# EAGLE schematic frontplatine_final (EAGLE 6.3)
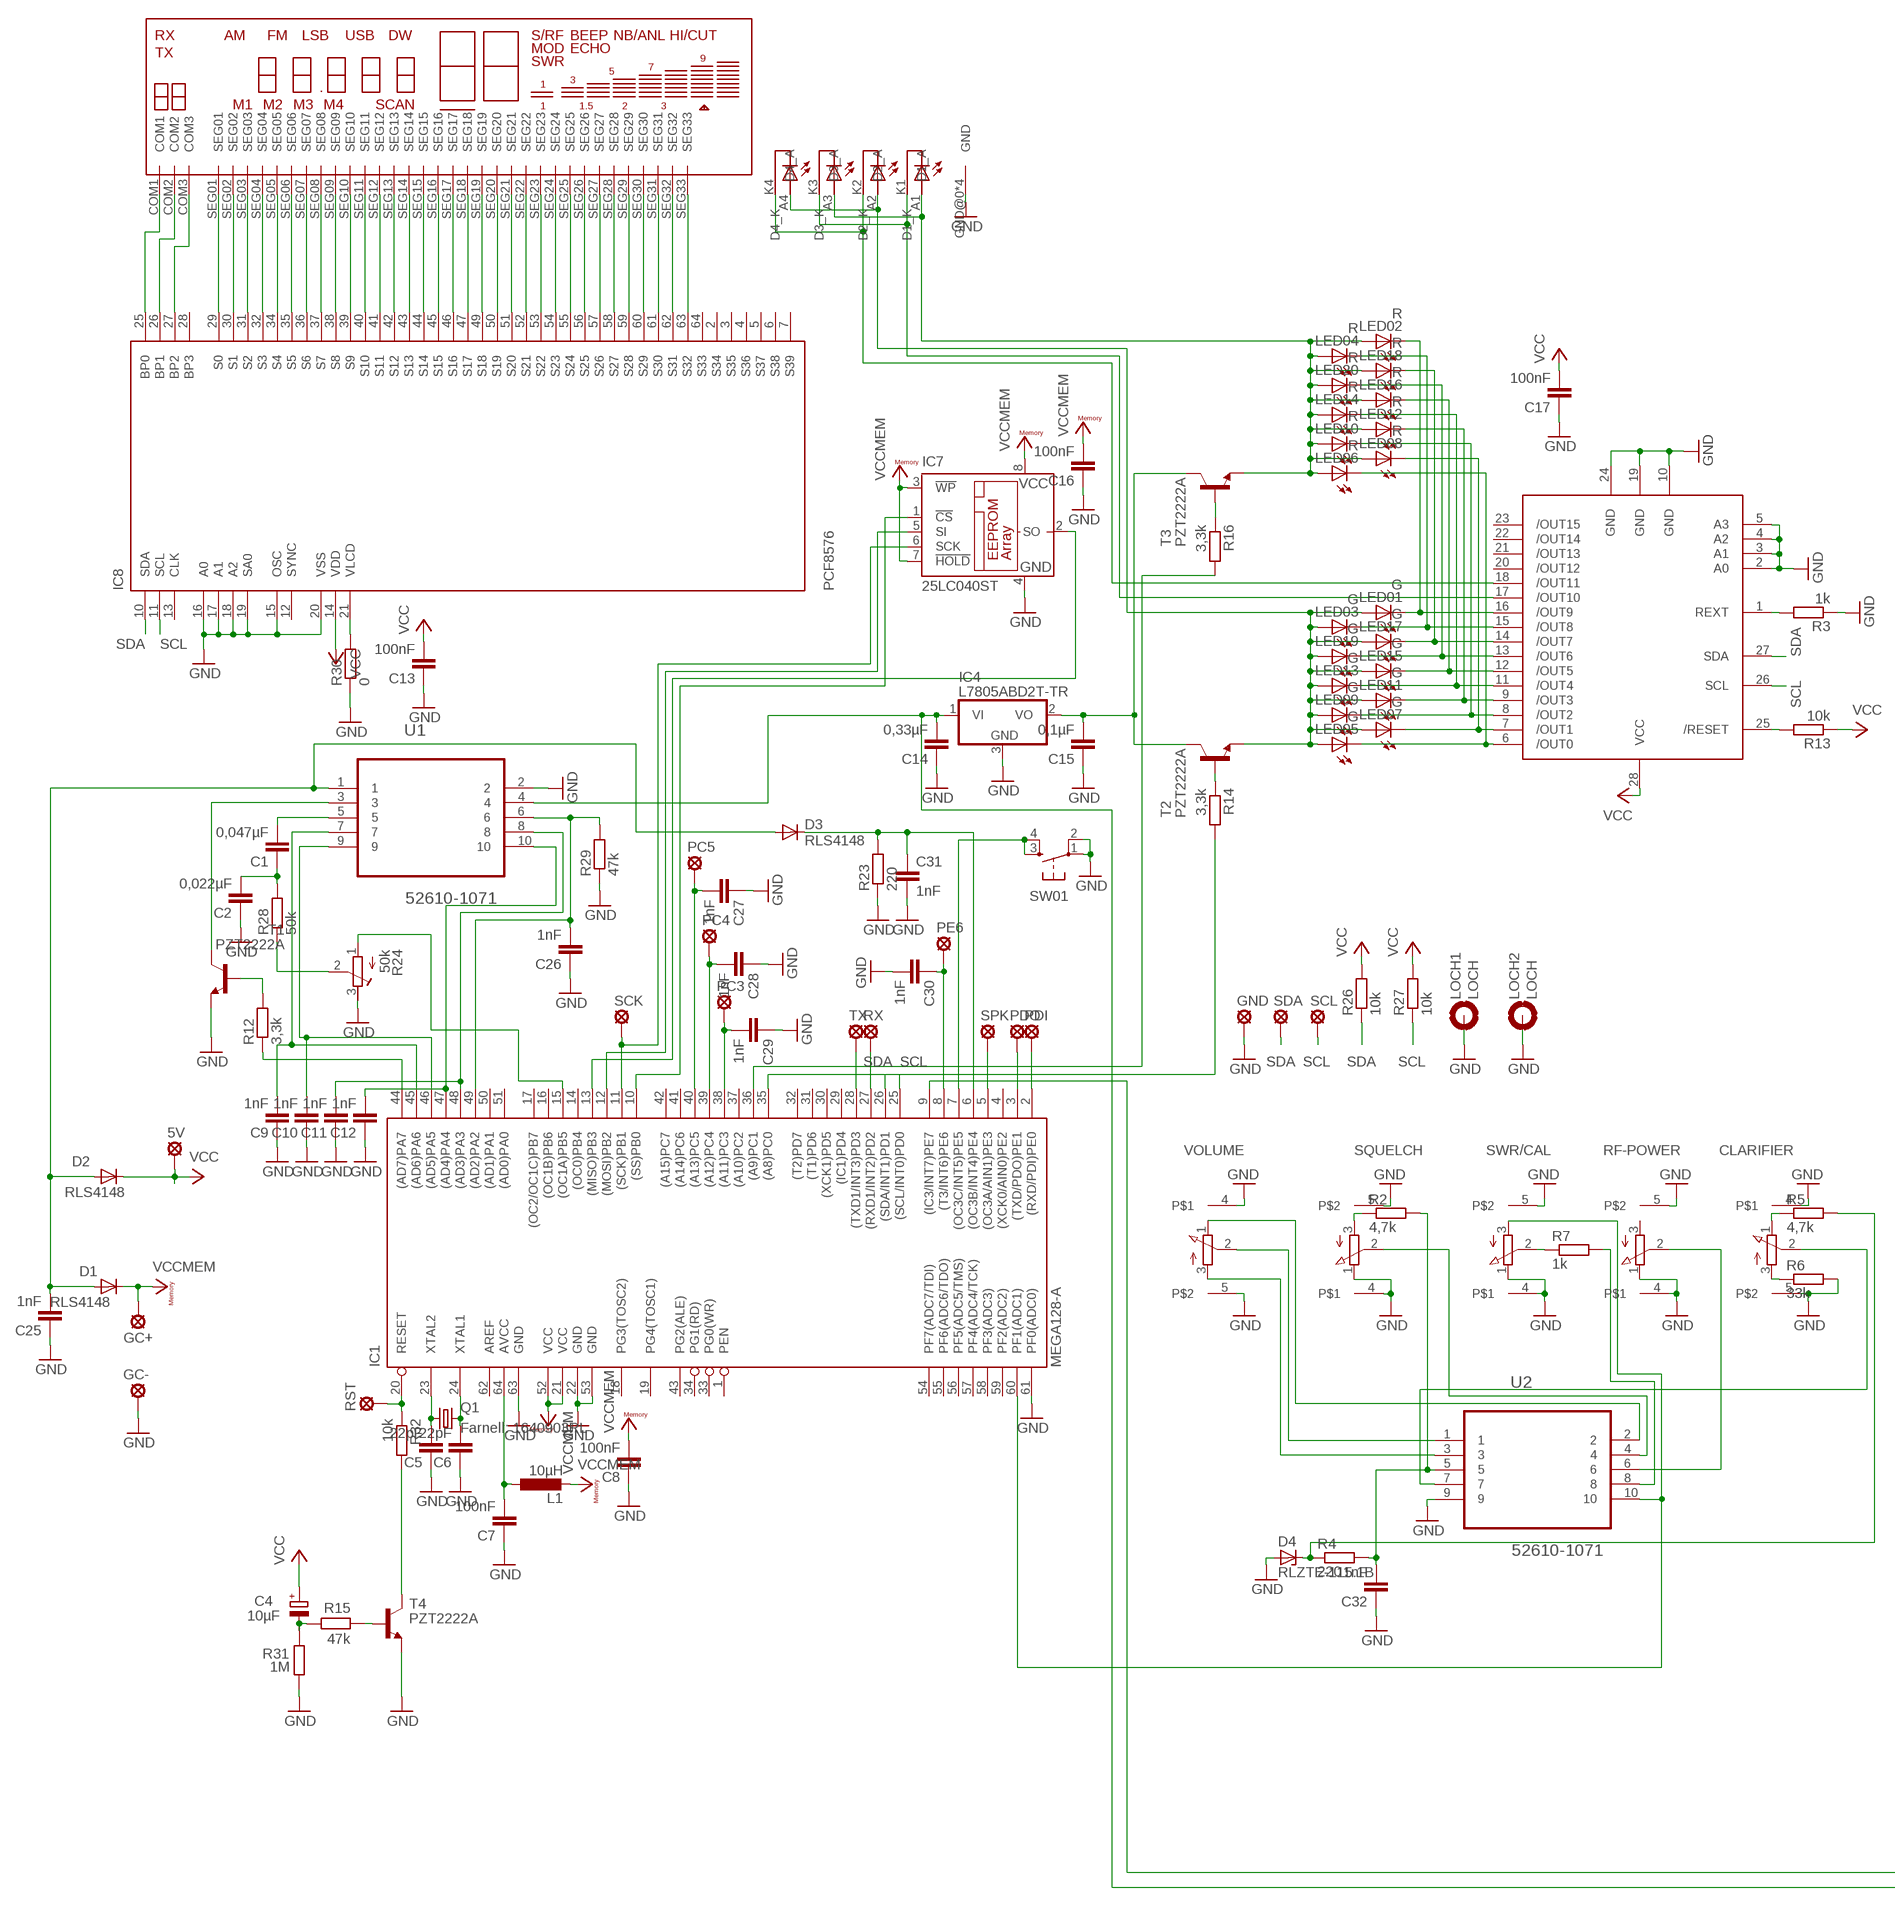
[diagram p0: schematic, sheet 1, part 1 of 2]
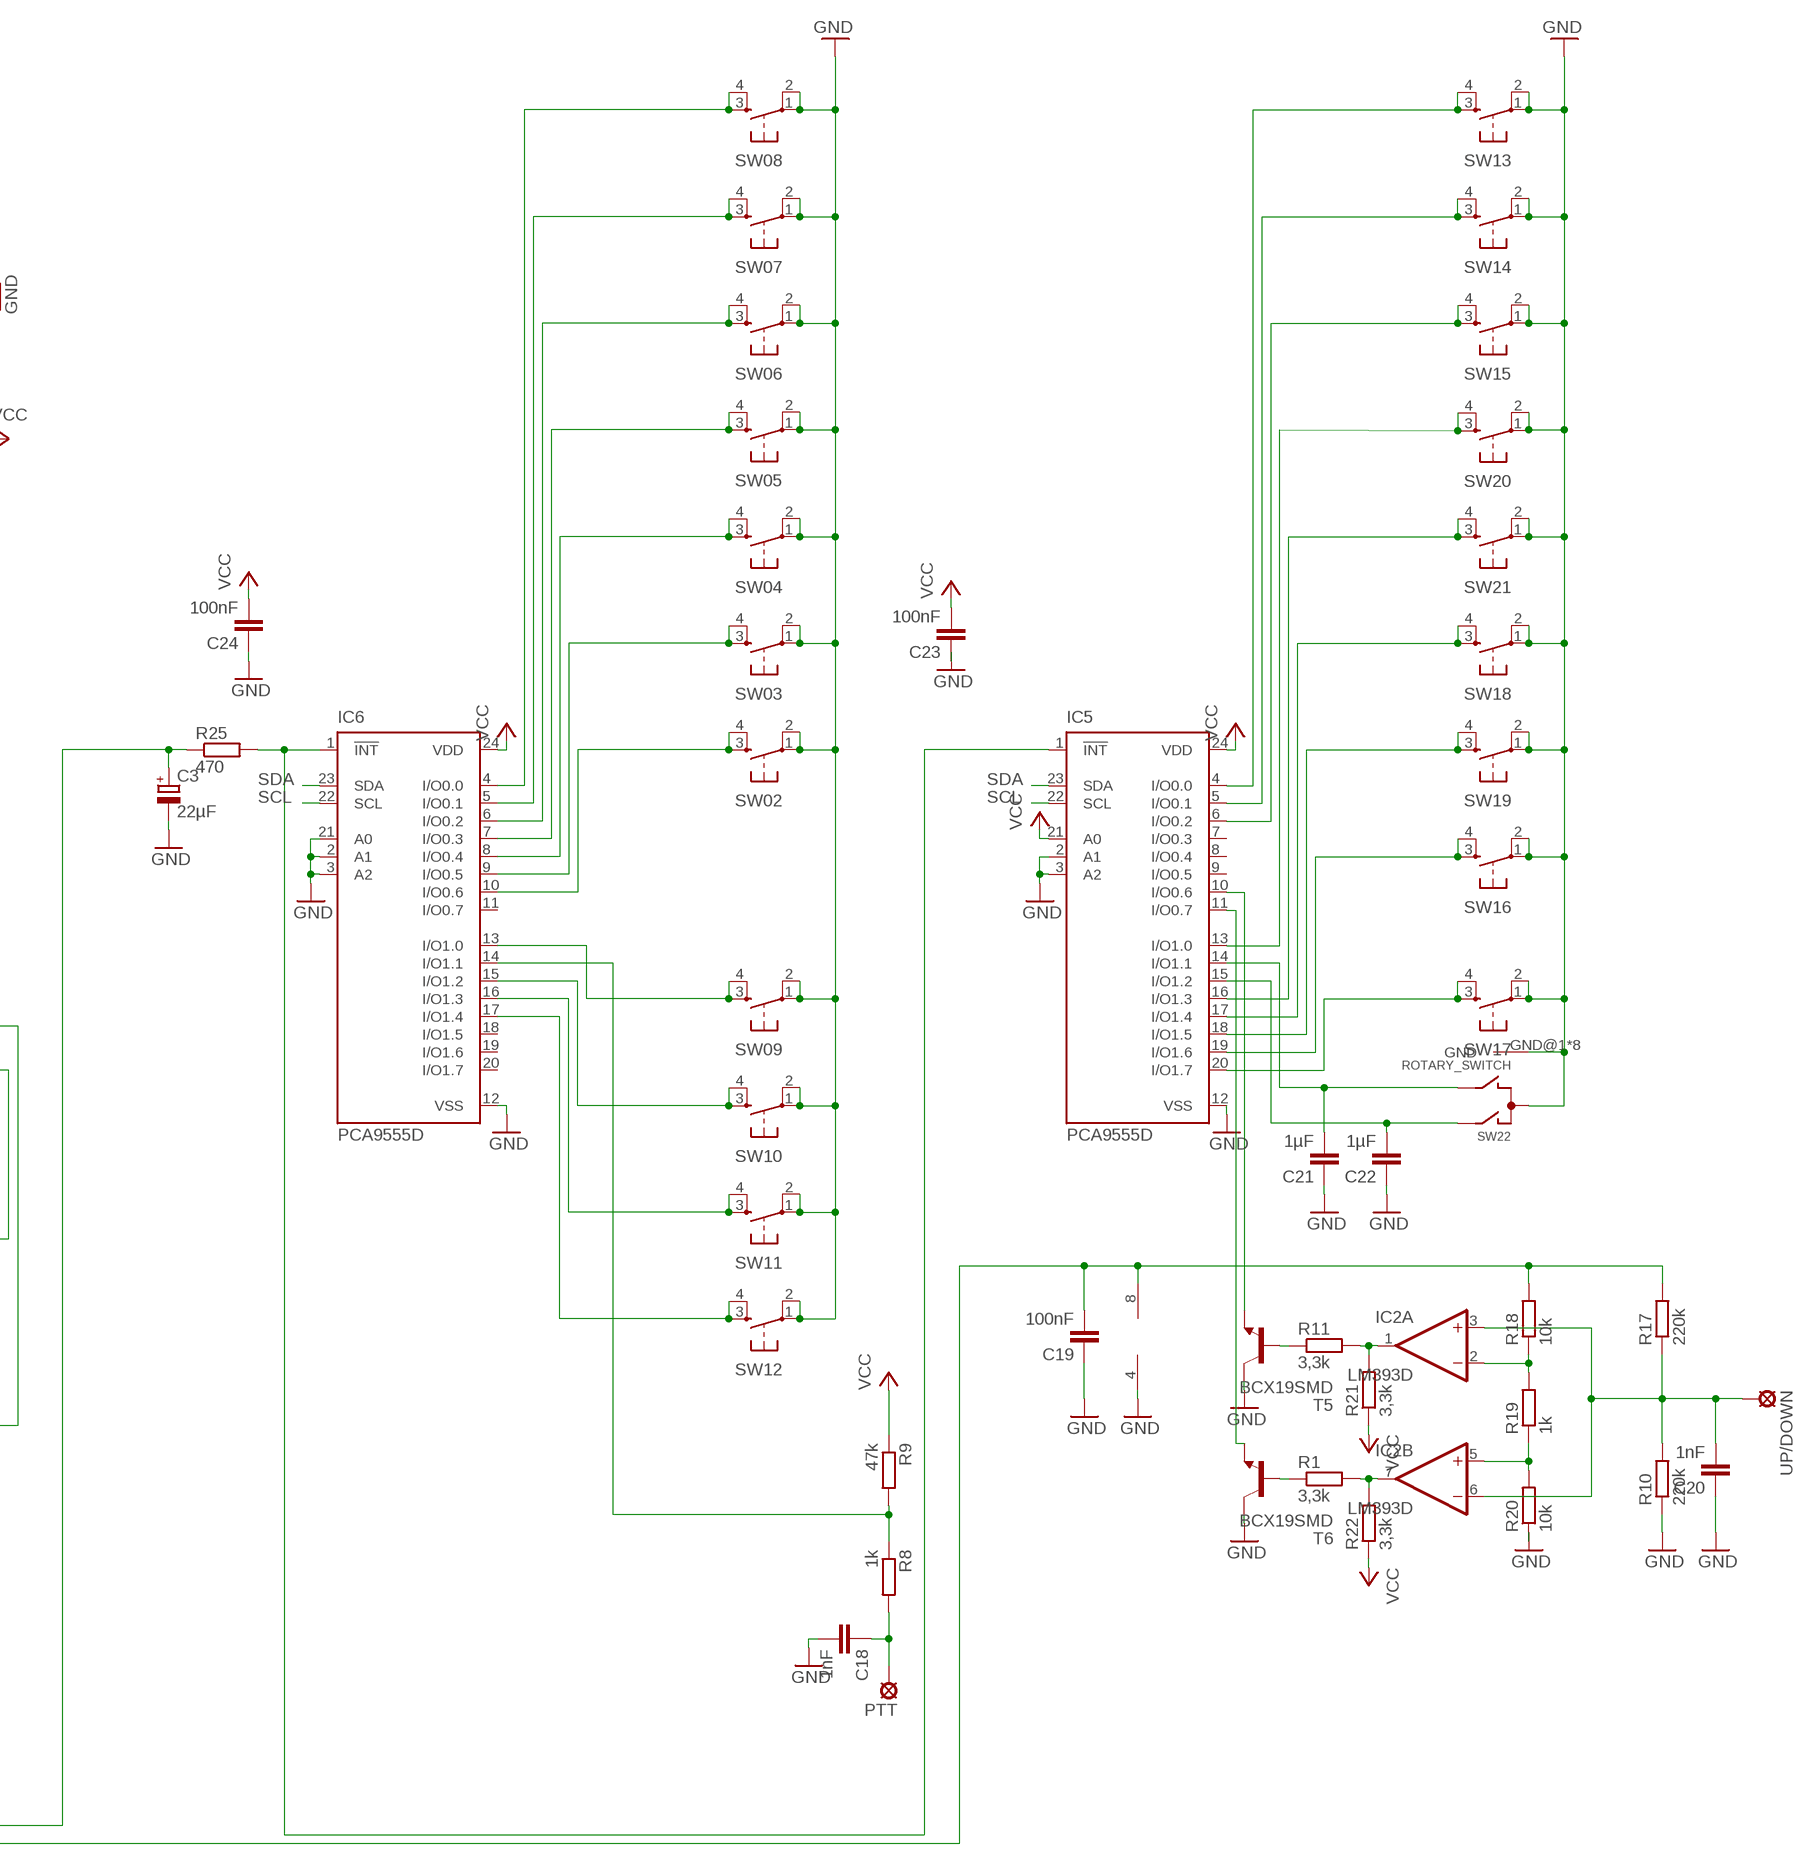
[diagram p1: schematic, sheet 1, part 2 of 2]

## Parts
5V  SE11  [SE11]
C1  0,047µF  C-EUC1206  [C1206]
C2  0,022µF  C-EUC1206  [C1206]
C3  22µF  CPOL-EUCT3216  [CT3216]
C4  10µF  CPOL-EUCT3216  [CT3216]
C5  22pF  C-EUC1206  [C1206]
C6  22pF  C-EUC1206  [C1206]
C7  100nF  C-EUC1206  [C1206]
C8  100nF  C-EUC1206  [C1206]
C9  1nF  C-EUC1206  [C1206]
C10  1nF  C-EUC1206  [C1206]
C11  1nF  C-EUC1206  [C1206]
C12  1nF  C-EUC1206  [C1206]
C13  100nF  C-EUC1206  [C1206]
C14  0,33µF  C-EUC1206  [C1206]
C15  0,1µF  C-EUC1206  [C1206]
C16  100nF  C-EUC1206  [C1206]
C17  100nF  C-EUC1206  [C1206]
C18  1nF  C-EUC1206  [C1206]
C19  100nF  C-EUC1206  [C1206]
C20  1nF  C-EUC1206  [C1206]
C21  1µF  C-EUC1206  [C1206]
C22  1µF  C-EUC1206  [C1206]
C23  100nF  C-EUC1206  [C1206]
C24  100nF  C-EUC1206  [C1206]
C25  1nF  C-EUC1206  [C1206]
C26  1nF  C-EUC1206  [C1206]
C27  1nF  C-EUC1206  [C1206]
C28  1nF  C-EUC1206  [C1206]
C29  1nF  C-EUC1206  [C1206]
C30  1nF  C-EUC1206  [C1206]
C31  1nF  C-EUC1206  [C1206]
C32  1nF  C-EUC1206  [C1206]
CLARIFIER  POTI  [POTI]
D1  RLS4148  DIODE-SOD80C  [SOD80C]
D2  RLS4148  DIODE-SOD80C  [SOD80C]
D3  RLS4148  DIODE-SOD80C  [SOD80C]
D4  RLZTE-115.1B  ZENER-DIODESOD80C  [SOD80C]
DISPLAY1  DISPLAY  [DISPLAY]
GC+  SE11  [SE11]
GC-  SE11  [SE11]
GND  SE11  [SE11]
IC1  MEGA128-A  [TQFP64]
IC2  LM393D  [SO08]
IC3  TLC59116  [TSSOP28]
IC4  L7805ABD2T-TR  7805DT  [TO252]
IC5  PCA9555D  [SO24]
IC6  PCA9555D  [SO24]
IC7  25LC040ST  [TSSOP8]
IC8  PCF8576  [64LQFP]
L1  10µH  L-EUL1812  [L1812]
LED01  G  LEDCHIPLED_1206  [CHIPLED_1206]
LED02  R  LEDCHIPLED_1206  [CHIPLED_1206]
LED03  G  LEDCHIPLED_1206  [CHIPLED_1206]
LED04  R  LEDCHIPLED_1206  [CHIPLED_1206]
LED05  G  LEDCHIPLED_1206  [CHIPLED_1206]
LED06  R  LEDCHIPLED_1206  [CHIPLED_1206]
LED07  G  LEDCHIPLED_1206  [CHIPLED_1206]
LED08  R  LEDCHIPLED_1206  [CHIPLED_1206]
LED09  G  LEDCHIPLED_1206  [CHIPLED_1206]
LED10  R  LEDCHIPLED_1206  [CHIPLED_1206]
LED11  G  LEDCHIPLED_1206  [CHIPLED_1206]
LED12  R  LEDCHIPLED_1206  [CHIPLED_1206]
LED13  G  LEDCHIPLED_1206  [CHIPLED_1206]
LED14  R  LEDCHIPLED_1206  [CHIPLED_1206]
LED15  G  LEDCHIPLED_1206  [CHIPLED_1206]
LED16  R  LEDCHIPLED_1206  [CHIPLED_1206]
LED17  G  LEDCHIPLED_1206  [CHIPLED_1206]
LED18  R  LEDCHIPLED_1206  [CHIPLED_1206]
LED19  G  LEDCHIPLED_1206  [CHIPLED_1206]
LED20  R  LEDCHIPLED_1206  [CHIPLED_1206]
LOCH1  LOCH  [LOCH]
LOCH2  LOCH  [LOCH]
PC3  SE11  [SE11]
PC4  SE11  [SE11]
PC5  SE11  [SE11]
PDI  SE11  [SE11]
PDO  SE11  [SE11]
PE6  SE11  [SE11]
PTT  SE11  [SE11]
Q1  Farnell: 1640903RL  CRYSTALHC49UP  [HC49UP]
R1  3,3k  R-EU_R1206  [R1206]
R2  4,7k  R-EU_R1206  [R1206]
R3  1k  R-EU_R1206  [R1206]
R4  220  R-EU_R1206  [R1206]
R5  4,7k  R-EU_R1206  [R1206]
R6  33k  R-EU_R1206  [R1206]
R7  1k  R-EU_R1206  [R1206]
R8  1k  R-EU_R1206  [R1206]
R9  47k  R-EU_R1206  [R1206]
R10  220k  R-EU_R1206  [R1206]
R11  3,3k  R-EU_R1206  [R1206]
R12  3,3k  R-EU_R1206  [R1206]
R13  10k  R-EU_R1206  [R1206]
R14  3,3k  R-EU_R1206  [R1206]
R15  47k  R-EU_R1206  [R1206]
R16  3,3k  R-EU_R1206  [R1206]
R17  220k  R-EU_R1206  [R1206]
R18  10k  R-EU_R1206  [R1206]
R19  1k  R-EU_R1206  [R1206]
R20  10k  R-EU_R1206  [R1206]
R21  3,3k  R-EU_R1206  [R1206]
R22  3,3k  R-EU_R1206  [R1206]
R23  220  R-EU_R1206  [R1206]
R24  50k  R-TRIMM3314J  [RTRIM3314J]
R25  470  R-EU_R1206  [R1206]
R26  10k  R-EU_R1206  [R1206]
R27  10k  R-EU_R1206  [R1206]
R28  50k  R-EU_R1206  [R1206]
R29  47k  R-EU_R1206  [R1206]
R30  0  R-EU_R1206  [R1206]
R31  1M  R-EU_R1206  [R1206]
R32  10k  R-EU_R1206  [R1206]
RF-POWER  POTI  [POTI]
RST  SE11  [SE11]
RX  SE11  [SE11]
SCK  SE11  [SE11]
SCL  SE11  [SE11]
SDA  SE11  [SE11]
SPK  SE11  [SE11]
SQUELCH  POTI  [POTI]
SW01  TASTER  [TASTER]
SW02  TASTER  [TASTER]
SW03  TASTER  [TASTER]
SW04  TASTER  [TASTER]
SW05  TASTER  [TASTER]
SW06  TASTER  [TASTER]
SW07  TASTER  [TASTER]
SW08  TASTER  [TASTER]
SW09  TASTER  [TASTER]
SW10  TASTER  [TASTER]
SW11  TASTER  [TASTER]
SW12  TASTER  [TASTER]
SW13  TASTER  [TASTER]
SW14  TASTER  [TASTER]
SW15  TASTER  [TASTER]
SW16  TASTER  [TASTER]
SW17  TASTER  [TASTER]
SW18  TASTER  [TASTER]
SW19  TASTER  [TASTER]
SW20  TASTER  [TASTER]
SW21  TASTER  [TASTER]
SW22  ROTARY_SWITCH  [ROTARY_SWITCH]
SWR/CAL  POTI  [POTI]
T1  PZT2222A  PZT2222A-NPN-SOT223  [SOT223]
T2  PZT2222A  PZT2222A-NPN-SOT223  [SOT223]
T3  PZT2222A  PZT2222A-NPN-SOT223  [SOT223]
T4  PZT2222A  PZT2222A-NPN-SOT223  [SOT223]
T5  BCX19SMD  [SOT23-BEC]
T6  BCX19SMD  [SOT23-BEC]
TX  SE11  [SE11]
U1  52610-1071  [MOLEX_52610-1071]
U2  52610-1071  [MOLEX_52610-1071]
UP/DOWN  SE11  [SE11]
VOLUME  POTI  [POTI]

## Nets
GND [GND]: C2.1 C3.- C5.1 C6.1 C7.1 C8.1 C9.1 C10.1 C11.1 C12.1 C13.1 C14.1 C15.1 C16.1 C17.1 C18.2 C19.1 C20.1 C21.1 C22.1 C23.1 C24.1 C25.1 C26.1 C27.1 C28.1 C29.1 C30.2 C31.2 C32.1 CLARIFIER.4 CLARIFIER.5 D4.A DISPLAY1.GND@0(GND) DISPLAY1.GND@3(GND) DISPLAY1.GND@6(GND) DISPLAY1.GND@7(GND) GC-.MP GND.MP IC1.22(GND) IC1.53(GND) IC1.61(PF0(ADC0)) IC1.63(GND) IC2.4(P:V-) IC3.2(A0) IC3.3(A1) IC3.4(A2) IC3.5(A3) IC3.10(GND) IC3.19(GND) IC3.24(GND) IC4.3(GND) IC5.2(A1) IC5.3(A2) IC5.12(VSS) IC6.2(A1) IC6.3(A2) IC6.12(VSS) IC6.21(A0) IC7.4(GND) IC8.15(OSC) IC8.16(A0) IC8.17(A1) IC8.18(A2) IC8.19(SA0) IC8.20(VSS) LOCH1.B3,0(MOUNT) LOCH2.B3,0(MOUNT) R3.1 R6.2 R10.1 R20.1 R23.1 R24.3(A) R29.1 R30.1 R31.2 RF-POWER.1(E) RF-POWER.4 RF-POWER.5 SQUELCH.1(E) SQUELCH.4 SQUELCH.5 SW01.1 SW01.2 SW02.1 SW02.2 SW03.1 SW03.2 SW04.1 SW04.2 SW05.1 SW05.2 SW06.1 SW06.2 SW07.1 SW07.2 SW08.1 SW08.2 SW09.1 SW09.2 SW10.1 SW10.2 SW11.1 SW11.2 SW12.1 SW12.2 SW13.1 SW13.2 SW14.1 SW14.2 SW15.1 SW15.2 SW16.1 SW16.2 SW17.1 SW17.2 SW18.1 SW18.2 SW19.1 SW19.2 SW20.1 SW20.2 SW21.1 SW21.2 SW22.C SW22.GND@1(GND) SW22.GND@2(GND) SW22.GND@3(GND) SW22.GND@4(GND) SW22.GND@5(GND) SW22.GND@6(GND) SW22.GND@7(GND) SW22.GND@8(GND) SWR/CAL.1(E) SWR/CAL.4 SWR/CAL.5 T1.3(E) T4.3(E) T5.C T6.C U1.2 U2.9 VOLUME.4 VOLUME.5
N$1: DISPLAY1.SEG01 IC8.29(S0)
N$2: U2.1 VOLUME.2(S)
N$3: U2.2 VOLUME.1(E)
N$4: U2.3 VOLUME.3(A)
N$5: D4.C R4.1 R5.2
N$6: SQUELCH.2(S) U2.4
N$7: R2.1 SQUELCH.3(A)
N$8: C32.2 R2.2 R4.2 U2.5
N$9: RF-POWER.2(S) U2.6
N$10: CLARIFIER.1(E) R5.1
N$11: CLARIFIER.2(S) U2.7
N$12: CLARIFIER.3(A) R6.1
N$13: IC3.7(/OUT1) LED07.C LED08.C
N$14: R7.2 U2.8
N$15: R7.1 SWR/CAL.2(S)
N$16: DISPLAY1.SEG02 IC8.30(S1)
N$17: IC6.14(I/O1.1) R8.1 R9.2
N$18: C18.1 PTT.MP R8.2
N$19: IC6.10(I/O0.6) SW02.3 SW02.4
N$20: T1.4(C) U1.3
N$21: DISPLAY1.SEG03 IC8.31(S2)
N$22: DISPLAY1.SEG04 IC8.32(S3)
N$23: IC3.8(/OUT2) LED09.C LED10.C
N$24: R12.2 T1.1(B)
N$25: C30.1 IC1.8((T3/INT6)PE6) PE6.MP
N$26: DISPLAY1.SEG05 IC8.34(S4)
N$27: C6.2 IC1.24(XTAL1) Q1.2
N$28: IC1.20(RESET) R32.1 RST.MP
N$29: DISPLAY1.SEG06 IC8.35(S5)
N$30: DISPLAY1.COM1 IC8.25(BP0)
N$31: C5.2 IC1.23(XTAL2) Q1.1
N$32: IC5.20(I/O1.7) SW17.3 SW17.4
N$33: IC3.9(/OUT3) LED11.C LED12.C
N$34: IC3.11(/OUT4) LED13.C LED14.C
N$35: IC3.14(/OUT7) LED17.C LED18.C
N$36: IC3.15(/OUT8) LED03.C LED04.C
N$37: IC3.16(/OUT9) LED01.C LED02.C
N$38: IC3.12(/OUT5) LED15.C LED16.C
N$39: IC3.13(/OUT6) LED19.C LED20.C
N$40: IC3.6(/OUT0) LED05.C LED06.C
N$41: DISPLAY1.K1(D1_K) DISPLAY1.K3(D3_K) IC3.17(/OUT10)
N$42: C20.2 IC2.3(A:+IN) IC2.6(B:-IN) R10.2 R17.1 UP/DOWN.MP
N$43 [SUPPLY LED]: IC3.1(REXT) R3.2
N$44: IC3.25(/RESET) R13.2
N$45: DISPLAY1.COM2 IC8.26(BP1)
N$46 [SUPPLY LED]: DISPLAY1.A2(D2_A) DISPLAY1.A4(D4_A) LED01.A LED03.A LED05.A LED07.A LED09.A LED11.A LED13.A LED15.A LED17.A LED19.A T2.3(E)
N$47 [SUPPLY LED]: DISPLAY1.A1(D1_A) DISPLAY1.A3(D3_A) LED02.A LED04.A LED06.A LED08.A LED10.A LED12.A LED14.A LED16.A LED18.A LED20.A T3.3(E)
N$48: DISPLAY1.COM3 IC8.27(BP2)
N$49: R16.1 T3.1(B)
N$50 [SUPPLY LED]: C14.2 C19.2 IC2.8(P:V+) IC4.1(VI) R17.2 R18.2 U1.4
N$51: IC1.36((A9)PC1) R16.2
N$52: DISPLAY1.SEG07 IC8.36(S6)
N$53: DISPLAY1.SEG08 IC8.37(S7)
N$54: DISPLAY1.SEG09 IC8.38(S8)
N$55: C21.2 IC5.14(I/O1.1) SW22.B
N$56: IC1.60(PF1(ADC1)) SWR/CAL.3(A) U2.10
N$57: IC6.9(I/O0.5) SW03.3 SW03.4
N$58: IC6.8(I/O0.4) SW04.3 SW04.4
N$59: IC6.7(I/O0.3) SW05.3 SW05.4
N$60: IC6.6(I/O0.2) SW06.3 SW06.4
N$61: IC6.5(I/O0.1) SW07.3 SW07.4
N$62: IC6.4(I/O0.0) SW08.3 SW08.4
N$63: C22.2 IC5.15(I/O1.2) SW22.A
N$64: IC6.15(I/O1.2) SW10.3 SW10.4
N$65: IC6.16(I/O1.3) SW11.3 SW11.4
N$66: IC6.17(I/O1.4) SW12.3 SW12.4
N$67: IC5.4(I/O0.0) SW13.3 SW13.4
N$68: C27.2 IC1.40((A13)PC5) PC5.MP
N$69: C28.2 IC1.39((A12)PC4) PC4.MP
N$70: C29.2 IC1.38((A11)PC3) PC3.MP
N$71: IC5.19(I/O1.6) SW16.3 SW16.4
N$72: IC5.16(I/O1.3) SW21.3 SW21.4
N$73: IC5.18(I/O1.5) SW19.3 SW19.4
N$74: IC8.21(VLCD) R30.2
N$75: IC1.7((OC3C/INT5)PE5) SW01.3 SW01.4
N$76: DISPLAY1.SEG10 IC8.39(S9)
N$77: DISPLAY1.SEG11 IC8.40(S10)
N$78: DISPLAY1.SEG12 IC8.41(S11)
N$79: DISPLAY1.SEG13 IC8.42(S12)
N$80: DISPLAY1.SEG14 IC8.43(S13)
N$81: DISPLAY1.SEG15 IC8.44(S14)
N$82: DISPLAY1.SEG16 IC8.45(S15)
N$83: DISPLAY1.SEG17 IC8.46(S16)
N$84: DISPLAY1.SEG18 IC8.47(S17)
N$85: DISPLAY1.SEG19 IC8.49(S18)
N$86: DISPLAY1.SEG20 IC8.50(S19)
N$87: DISPLAY1.SEG21 IC8.51(S20)
N$88: DISPLAY1.SEG22 IC8.52(S21)
N$89: DISPLAY1.SEG23 IC8.53(S22)
N$90: DISPLAY1.SEG24 IC8.54(S23)
N$91: DISPLAY1.SEG25 IC8.55(S24)
N$92: DISPLAY1.SEG26 IC8.56(S25)
N$93: DISPLAY1.SEG27 IC8.57(S26)
N$94: DISPLAY1.SEG28 IC8.58(S27)
N$95: DISPLAY1.SEG29 IC8.59(S28)
N$96: DISPLAY1.SEG30 IC8.60(S29)
N$97: DISPLAY1.SEG31 IC8.61(S30)
N$98: DISPLAY1.SEG32 IC8.62(S31)
N$99: DISPLAY1.SEG33 IC8.63(S32)
N$100: IC1.44((AD7)PA7) R12.1
N$101: C9.2 IC1.45((AD6)PA6) U1.7
N$102: C10.2 IC1.46((AD5)PA5) U1.9
N$103: C12.2 IC1.47((AD4)PA4) U1.10
N$104: C11.2 IC1.48((AD3)PA3) U1.8
N$105: IC1.15((OC1A)PB5) R24.1(E)
N$106: C26.2 IC1.49((AD2)PA2) R29.2 U1.6
N$107: C3.+ IC1.9((IC3/INT7)PE7) R25.1
N$108: IC1.35((A8)PC0) R14.2
N$109: IC1.10((SS)PB0) IC7.1(!CS)
N$110: R14.1 T2.1(B)
N$111: C31.1 D3.C IC1.6((OC3B/INT4)PE4) R23.2
N$112: C25.2 D1.A D2.A D3.A U1.1
N$113: IC1.13((MISO)PB3) IC7.2(SO)
N$114: IC1.12((MOSI)PB2) IC7.5(SI)
N$115: IC1.11((SCK)PB1) IC7.6(SCK) SCK.MP
N$116: IC2.5(B:+IN) R19.1 R20.2
N$117: IC2.2(A:-IN) R18.1 R19.2
N$118: IC5.17(I/O1.4) SW18.3 SW18.4
N$119: IC2.1(A:OUT) R11.2 R21.2
N$120: IC2.7(B:OUT) R1.2 R22.2
N$121: DISPLAY1.K2(D2_K) DISPLAY1.K4(D4_K) IC3.18(/OUT11)
N$122: IC5.10(I/O0.6) T5.E
N$123: IC5.6(I/O0.2) SW15.3 SW15.4
N$124: IC5.11(I/O0.7) T6.E
N$125: C1.2 U1.5
N$126: C1.1 C2.2 R28.2
N$127: IC1.5((OC3A/AIN1)PE3) SPK.MP
N$128: R24.2(S) R28.1
N$129: IC1.3((TXD/PDO)PE1) PDO.MP
N$130: IC1.2((RXD/PDI)PE0) PDI.MP
N$131: IC1.28((TXD1/INT3)PD3) TX.MP
N$132: IC1.27((RXD1/INT2)PD2) RX.MP
N$133: R11.1 T5.B
N$134: R32.2 T4.4(C)
N$135: C4.- R15.2 R31.1
N$136: R15.1 T4.1(B)
N$137: IC6.13(I/O1.0) SW09.3 SW09.4
N$138: R1.1 T6.B
N$139: C7.2 IC1.64(AVCC) L1.1
N$140: IC5.5(I/O0.1) SW14.3 SW14.4
N$141: IC5.13(I/O1.0) SW20.3 SW20.4
N$142: IC5.1(!INT) IC6.1(!INT) R25.2
N$144 [SUPPLY LED]: C15.2 IC4.2(VO) T2.4(C) T3.4(C)
SCL: IC1.25((SCL/INT0)PD0) IC3.26(SCL) IC5.22(SCL) IC6.22(SCL) IC8.11(SCL) R27.1 SCL.MP
SDA: IC1.26((SDA/INT1)PD1) IC3.27(SDA) IC5.23(SDA) IC6.23(SDA) IC8.10(SDA) R26.1 SDA.MP
VCC [GND]: 5V.MP C4.+ C13.2 C17.2 C23.2 C24.2 D2.C IC3.28(VCC) IC5.21(A0) IC5.24(VDD) IC6.24(VDD) IC8.14(VDD) R9.1 R13.1 R21.1 R22.1 R26.2 R27.2
VCCMEM: C8.2 C16.2 D1.C GC+.MP IC1.21(VCC) IC1.52(VCC) IC7.3(!WP) IC7.7(!HOLD) IC7.8(VCC) L1.2
Unconnected: IC1.1(PEN) IC1.4((XCK0/AIN0)PE2) IC1.14((OC0)PB4) IC1.16((OC1B)PB6) IC1.17((OC2/OC1C)PB7) IC1.18(PG3(TOSC2)) IC1.19(PG4(TOSC1)) IC1.29((IC1)PD4) IC1.30((XCK1)PD5) IC1.31((T1)PD6) IC1.32((T2)PD7) IC1.33(PG0(WR)) IC1.34(PG1(RD)) IC1.37((A10)PC2) IC1.41((A14)PC6) IC1.42((A15)PC7) IC1.43(PG2(ALE)) IC1.50((AD1)PA1) IC1.51((AD0)PA0) IC1.54(PF7(ADC7/TDI)) IC1.55(PF6(ADC6/TDO)) IC1.56(PF5(ADC5/TMS)) IC1.57(PF4(ADC4/TCK)) IC1.58(PF3(ADC3)) IC1.59(PF2(ADC2)) IC1.62(AREF) IC3.20(/OUT12) IC3.21(/OUT13) IC3.22(/OUT14) IC3.23(/OUT15) IC5.7(I/O0.3) IC5.8(I/O0.4) IC5.9(I/O0.5) IC6.11(I/O0.7) IC6.18(I/O1.5) IC6.19(I/O1.6) IC6.20(I/O1.7) IC8.2(S34) IC8.3(S35) IC8.4(S36) IC8.5(S37) IC8.6(S38) IC8.7(S39) IC8.12(SYNC) IC8.13(CLK) IC8.28(BP3) IC8.64(S33) RF-POWER.3(A)

## Library data of the parts
5V GC+ GC- GND PC3-PC5 PDI PDO PE6 PTT RST RX SCK SCL SDA SPK TX UP/DOWN = solpad:SE11: SOLDER PAD RTM, drill 1,1mm, distributor Buerklin, 07F810
C1 = rcl:C-EU: CAPACITOR, European symbol
C2 C5-C32 = resistor:C-EU: CAPACITOR, European symbol
C3 C4 = rcl:CPOL-EU: POLARIZED CAPACITOR, European symbol
CLARIFIER RF-POWER SQUELCH SWR/CAL VOLUME = president_george:POTI
D1-D3 = diode:DIODE-: DIODE
D4 = diode:ZENER-DIODE: Z-Diode
DISPLAY1 = president_george:DISPLAY: Display President George
IC1 = atmel:MEGA128: MICROCONTROLLER 128 Kbytes FLASH 4 Kbytes SRAM 4 Kbytes EEPROM DUAL USART 8-channel 10 bit ADC Source: avr.lbr; MPN: ATMEGA128-16AU; OC_FARNELL: 9171118; OC_NEWARK: 95K7364
IC2 = linear:LM393: COMPARATOR
IC3 = tlc:TLC59116
IC4 = linear:78*: Positive VOLTAGE REGULATOR Source: http://cache.national.com/ds/LM/LM78L05.pdf http://www.fairchildsemi.com/ds/LM/LM7805.pdf
IC5 IC6 = micro-philips:PCA9555: 16-bit I2C and SMBus I/O port with interrupt Source: PCA9555_5.pdf; MPN: PCA9555DW; OC_FARNELL: 1408295; OC_NEWARK: 63K6067
IC7 = microchip:25*: Serial EEPROM 4K/ 8K , SPI bus; MF: MICROCHIP; MPN: 25LC040A-I/ST; OC_FARNELL: 1815998; OC_NEWARK: 72J3684
IC8 = pcf8576:PCF8576: PCF8576
L1 = rcl:L-EU: INDUCTOR, European symbol
LED01-LED09 LED10-LED20 = led:LED: LED OSRAM: - CHIPLED LG R971, LG N971, LY N971, LG Q971, LY Q971, LO R971, LY R971 LH N974, LH R974 LS Q976, LO Q976, LY Q976 LO Q996 - Hyper CHIPLED LW Q18S LB Q993, LB Q99A, LB R99A - SideLED LS A670, LO A670, LY A670, LG A670, LP A670 LB A673, LV A673, LT A673, LW A673 LH A674 LY A675 LS A676, LA A676, LO A676, LY A676, LW A676 LS A679, LY A679, LG A679 - Hyper Micro SIDELED® LS Y876, LA Y876, LO Y876, LY Y876 LT Y87S - SmartLED LW L88C, LW L88S LB L89C, LB L89S, LG L890 LS L89K, LO L89K, LY L89K LS L896, LA L896, LO L896, LY L896 - TOPLED LS T670, LO T670, LY T670, LG T670, LP T670 LSG T670, LSP T670, LSY T670, LOP T670, LYG T670 LG T671, LOG T671, LSG T671 LB T673, LV T673, LT T673, LW T673 LH T674 LS T676, LA T676, LO T676, LY T676, LB T676, LH T676, LSB T676, LW T676 LB T67C, LV T67C, LT T67C, LS T67K, LO T67K, LY T67K, LW E67C LS E67B, LA E67B, LO E67B, LY E67B, LB E67C, LV E67C, LT E67C LW T67C LS T679, LY T679, LG T679 LS T770, LO T770, LY T770, LG T770, LP T770 LB T773, LV T773, LT T773, LW T773 LH T774 LS E675, LA E675, LY E675, LS T675 LS T776, LA T776, LO T776, LY T776, LB T776 LHGB T686 LT T68C, LB T68C - Hyper Mini TOPLED® LB M676 - Mini TOPLED Santana® LG M470 LS M47K, LO M47K, LY M47K Source: http://www.osram.convergy.de LUXEON: - LUMILED® LXK2-PW12-R00, LXK2-PW12-S00, LXK2-PW14-U00, LXK2-PW14-V00 LXK2-PM12-R00, LXK2-PM12-S00, LXK2-PM14-U00 LXK2-PE12-Q00, LXK2-PE12-R00, LXK2-PE12-S00, LXK2-PE14-T00, LXK2-PE14-U00 LXK2-PB12-K00, LXK2-PB12-L00, LXK2-PB12-M00, LXK2-PB14-N00, LXK2-PB14-P00, LXK2-PB14-Q00 LXK2-PR12-L00, LXK2-PR12-M00, LXK2-PR14-Q00, LXK2-PR14-R00 LXK2-PD12-Q00, LXK2-PD12-R00, LXK2-PD12-S00 LXK2-PH12-R00, LXK2-PH12-S00 LXK2-PL12-P00, LXK2-PL12-Q00, LXK2-PL12-R00 Source: www.luxeon.com KINGBRIGHT: KA-3528ASYC Source: www.kingbright.com
LOCH1 LOCH2 = president_george:LOCH
Q1 = crystal:CRYSTAL: CRYSTAL; OC_FARNELL: unknown; OC_NEWARK: unknown
R1 R2 R4-R23 R25-R32 = resistor:R-EU_: RESISTOR, European symbol
R3 = rcl:R-EU_: RESISTOR, European symbol
R24 = resistor:R-TRIMM: Trimm resistor
SW01-SW09 SW10-SW21 = president_george:TASTER
SW22 = president_george:ROTARY_SWITCH
T1-T4 = transistor-neu-to92:*-NPN-: NPN Transistror
T5 T6 = transistor-npn:BCX19*: NPN Transistor
U1 U2 = Molex_By_element14_Batch_1:52610-1071: SOCKET FFC/FPC, ZIF, 1MM, 10WAY; MPN: 52610-1071; OC_FARNELL: 9786236; OC_NEWARK: 98K9782; PACKAGE: SOCKET FFC/FPC, ZIF, 1MM, 10WAY; SUPPLIER: Molex

## Net classes
0 default: width 0.125 mm, drill 0.25 mm
1 GND: width 0.25 mm, drill 0.5 mm
2 SUPPLY LED: width 0.25 mm, drill 0.5 mm